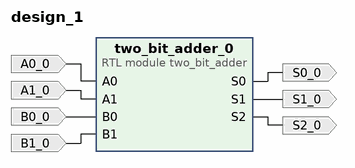
[diagram p0: block diagram of the top level]
# Vivado block design design_1, xc7z020clg400-1, Vivado 2019.1
create_bd_design design_1

create_bd_port -dir I A0_0
create_bd_port -dir I A1_0
create_bd_port -dir I B0_0
create_bd_port -dir I B1_0
create_bd_port -dir O S0_0
create_bd_port -dir O S1_0
create_bd_port -dir O S2_0

create_bd_cell -type module -reference two_bit_adder two_bit_adder_0

# ---- connections ----

connect_bd_net -net A0_0_1 [get_bd_ports A0_0] [get_bd_pins two_bit_adder_0/A0]
connect_bd_net -net A1_0_1 [get_bd_ports A1_0] [get_bd_pins two_bit_adder_0/A1]
connect_bd_net -net B0_0_1 [get_bd_ports B0_0] [get_bd_pins two_bit_adder_0/B0]
connect_bd_net -net B1_0_1 [get_bd_ports B1_0] [get_bd_pins two_bit_adder_0/B1]
connect_bd_net [get_bd_pins two_bit_adder_0/S0] [get_bd_ports S0_0]
connect_bd_net [get_bd_pins two_bit_adder_0/S1] [get_bd_ports S1_0]
connect_bd_net [get_bd_pins two_bit_adder_0/S2] [get_bd_ports S2_0]

validate_bd_design
save_bd_design
